# Altium schematic sheet PWR RAIL.SchDoc: USB-ETH
size A4; DrawnBy: Luca Schenetti; Revision: C; SheetNumber: 4; SheetTotal: 4
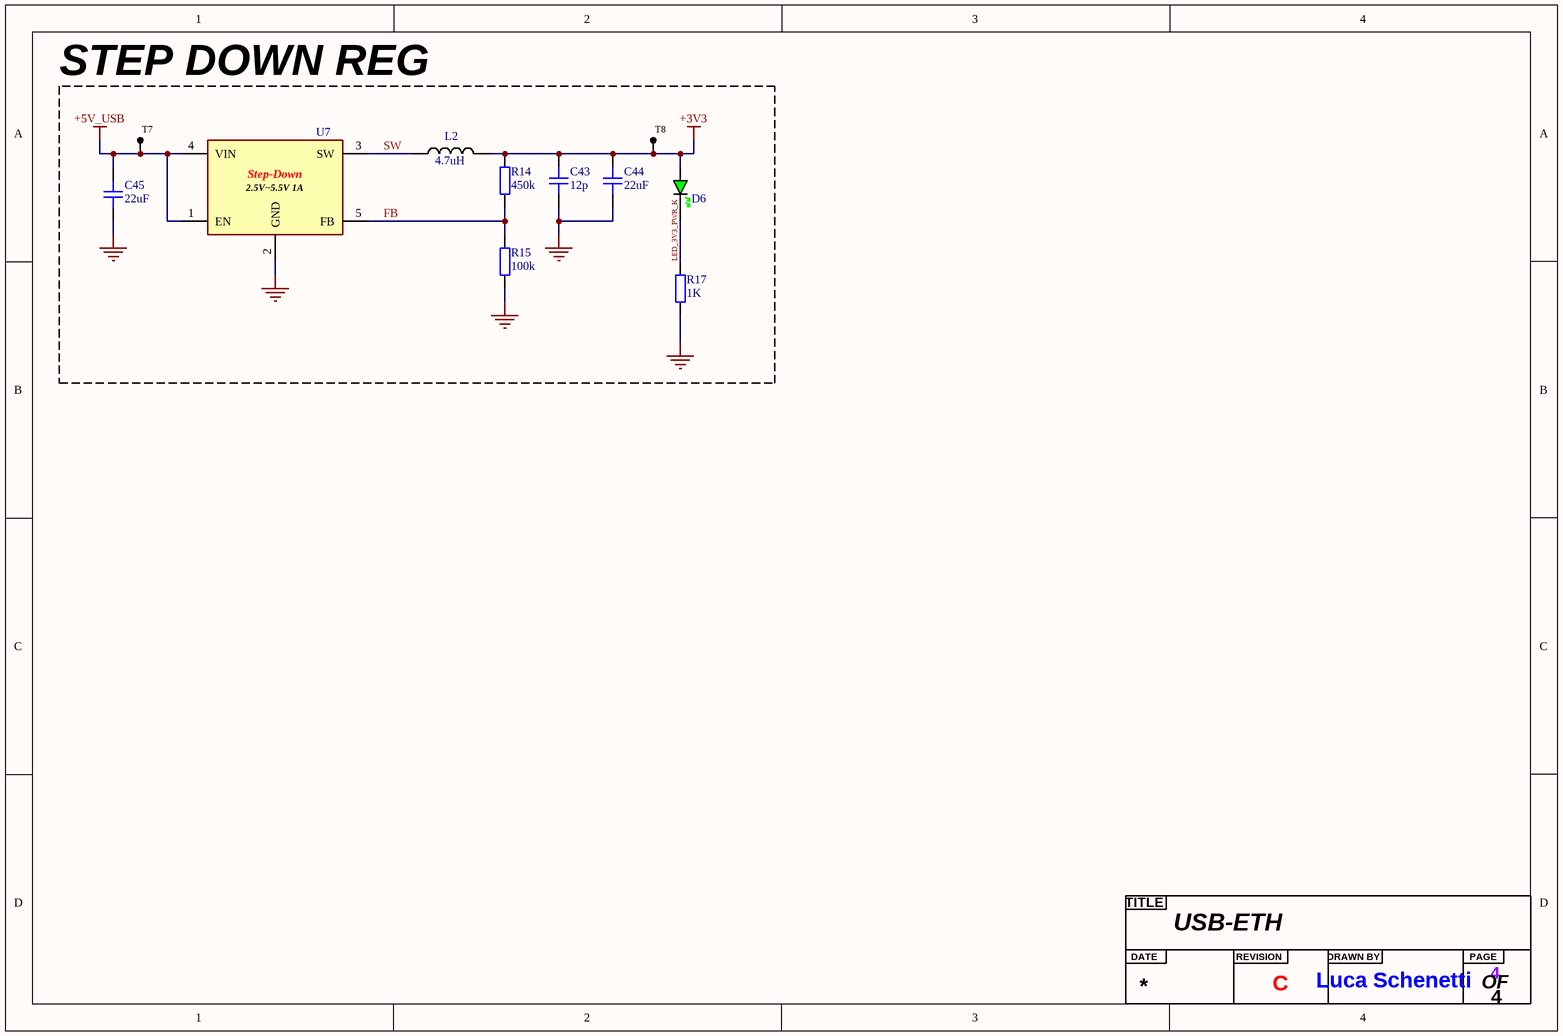
[diagram p0: PWR RAIL.SchDoc]

## Parts
?  Title  (value not drawn)  (graphical)
C43  12p  [CAP_0603]
C44  22uF  [CAP_0603]
C45  22uF  [CAP_0603]
D6  GREEN  [LED_0603_GREEN]  (value not drawn)
L2  4.7uH  [INDUCTOR 1210]
R14  450k  [RES_0402]
R15  100k  [RES_0402]
R17  1K  [RES_0402]
T7  TP_S  [TP 1mm]  (value not drawn)  (no BOM)
T8  TP_S  [TP 1mm]  (value not drawn)  (no BOM)
U7  BUCK CONVERTER 1A 2.5V~5.5V  [TLV62568DBVR]  (value not drawn)

## Blocks framed on the sheet
STEP DOWN REG: C43-C45 D6 L2 R14 R15 R17 T7 T8 U7

## Nets
+3V3: C43.2 C44.2 D6.A L2.2 R14.2 T8.1
+5V_USB: C45.2 T7.1 U7.1(EN) U7.4(VIN)
GND: C43.1 C44.1 C45.1 R15.1 R17.1 U7.2(GND)
FB: R14.1 R15.2 U7.5(FB)
LED_3V3_PWR_K: D6.K R17.2
SW: L2.1 U7.3(SW)

## Notes on the sheet
- (in symbol Title) TITLE; DATE; REVISION; DRAWN BY; PAGE; OF
- (in symbol TLV62568DBVR) Step-Down; 2.5V~5.5V 1A

## Library data of the parts
C43 = CAP_0603: [C38523]; Manufacturer: *; Manufacturer Part Number: *; Distributor Link: *; LCSC: *; Rating: *; Dielectric: *
C44 C45 = CAP_0603: [C59461]; Manufacturer: *; Manufacturer Part Number: *; Distributor Link: *; LCSC: *; Rating: *; Dielectric: *
D6 = LED_0603_GREEN: [C2986059]
L2 = INDUCTOR 1210: [C5832387]
R14 = RES_0402: [C5159688]; Manufacturer: *; Manufacturer Part Number: *; Distributor Link: *; LCSC: *
R15 = RES_0402: [C25741]; Manufacturer: *; Manufacturer Part Number: *; Distributor Link: *; LCSC: *
R17 = RES_0402: [C11702]; Manufacturer: *; Manufacturer Part Number: *; Distributor Link: *; LCSC: *
T7 T8 = TP_S: test point
U7 = TLV62568DBVR: [C163219]